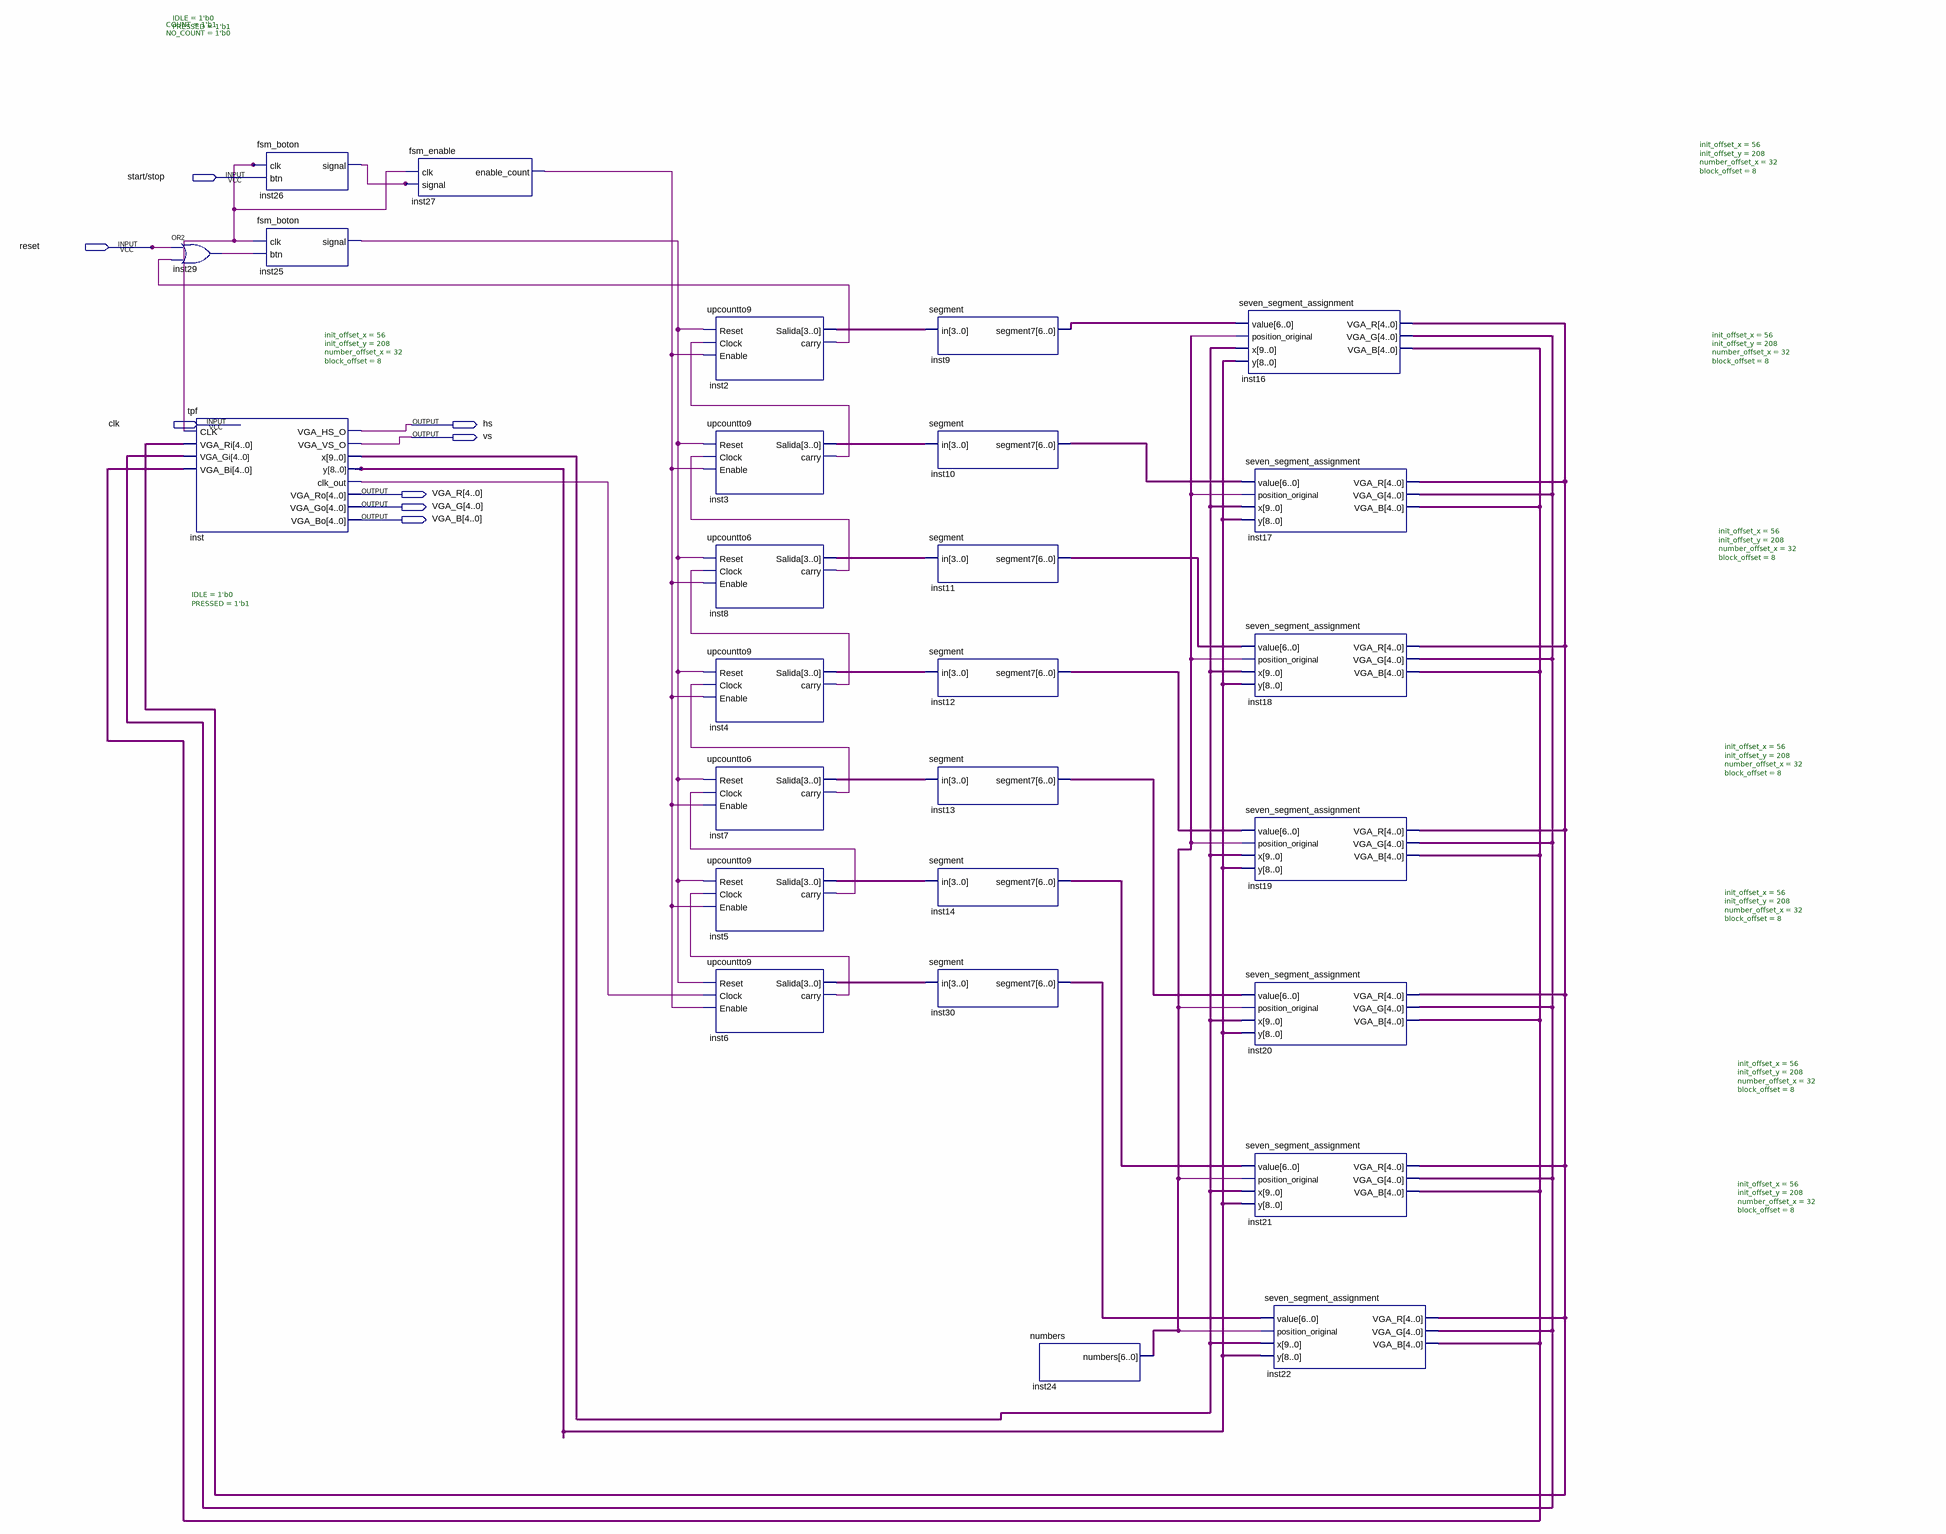
[diagram p0: schematic sheet]
// Quartus schematic TPfinalelectro3.bdf as structural Verilog: 27 symbols, 8 pins
module TPfinalelectro3 (
  input  \start/stop ,
  input  reset,
  input  clk,
  output hs,
  output vs,
  output [4:0] VGA_R,
  output [4:0] VGA_G,
  output [4:0] VGA_B
);

  wire inst2_carry, inst3_carry, inst4_carry, inst5_carry, inst6_carry, inst7_carry, inst8_carry,
       inst25_signal, inst26_signal, inst27_enable_count, inst29_out, inst_clk_out, undriven, undriven_2,
       undriven_3, undriven_4, undriven_5, undriven_6, undriven_7, undriven_8;
  wire [3:0] inst2_salida, inst3_salida, inst4_salida, inst5_salida, inst6_salida, inst7_salida, inst8_salida;
  wire [4:0] inst16_vga_b, inst16_vga_g, inst16_vga_r;
  wire [6:0] inst9_segment7, inst10_segment7, inst11_segment7, inst12_segment7, inst13_segment7,
       inst14_segment7, inst24_numbers, inst30_segment7;
  wire [8:0] inst_y;
  wire [9:0] inst_x;

  or inst29 (inst29_out, reset, inst2_carry);
  tpf #(.init_offset_x(56), .init_offset_y(208), .number_offset_x(32), .block_offset(8)) inst (
    .CLK(undriven_8), .VGA_Ri(inst16_vga_r), .VGA_Gi(inst16_vga_g), .VGA_Bi(inst16_vga_b), .VGA_HS_O(hs),
    .VGA_VS_O(vs), .x(inst_x), .y(inst_y), .clk_out(inst_clk_out), .VGA_Ro(VGA_R), .VGA_Go(VGA_G),
    .VGA_Bo(VGA_B));
  fsm_boton #(.IDLE(1'b0), .PRESSED(1'b1)) inst26 (.clk(undriven_8), .signal(inst26_signal));  // open: btn
  fsm_boton #(.IDLE(1'b0), .PRESSED(1'b1)) inst25 (.clk(undriven_8), .btn(inst29_out), .signal(inst25_signal));
  fsm_enable #(.COUNT(1'b1), .NO_COUNT(1'b0)) inst27 (
    .clk(undriven_8), .signal(inst26_signal), .enable_count(inst27_enable_count));
  upcountto9 inst2 (
    .Reset(inst25_signal), .Clock(inst3_carry), .Enable(inst27_enable_count), .Salida(inst2_salida),
    .carry(inst2_carry));
  upcountto9 inst3 (
    .Reset(inst25_signal), .Clock(inst8_carry), .Enable(inst27_enable_count), .Salida(inst3_salida),
    .carry(inst3_carry));
  upcountto6 inst8 (
    .Reset(inst25_signal), .Clock(inst4_carry), .Enable(inst27_enable_count), .Salida(inst8_salida),
    .carry(inst8_carry));
  upcountto9 inst4 (
    .Reset(inst25_signal), .Clock(inst7_carry), .Enable(inst27_enable_count), .Salida(inst4_salida),
    .carry(inst4_carry));
  upcountto6 inst7 (
    .Reset(inst25_signal), .Clock(inst5_carry), .Enable(inst27_enable_count), .Salida(inst7_salida),
    .carry(inst7_carry));
  upcountto9 inst5 (
    .Reset(inst25_signal), .Clock(inst6_carry), .Enable(inst27_enable_count), .Salida(inst5_salida),
    .carry(inst5_carry));
  upcountto9 inst6 (
    .Reset(inst25_signal), .Clock(inst_clk_out), .Enable(inst27_enable_count), .Salida(inst6_salida),
    .carry(inst6_carry));
  segment inst9 (.in(inst2_salida), .segment7(inst9_segment7));
  segment inst10 (.in(inst3_salida), .segment7(inst10_segment7));
  segment inst11 (.in(inst8_salida), .segment7(inst11_segment7));
  segment inst12 (.in(inst4_salida), .segment7(inst12_segment7));
  segment inst13 (.in(inst7_salida), .segment7(inst13_segment7));
  segment inst14 (.in(inst5_salida), .segment7(inst14_segment7));
  segment inst30 (.in(inst6_salida), .segment7(inst30_segment7));
  numbers inst24 (.numbers(inst24_numbers));
  seven_segment_assignment #(.init_offset_x(56), .init_offset_y(208), .number_offset_x(32), .block_offset(8)) inst16 (
    .value(inst9_segment7), .position_original(undriven), .x(inst_x), .y(inst_y), .VGA_R(inst16_vga_r),
    .VGA_G(inst16_vga_g), .VGA_B(inst16_vga_b));
  seven_segment_assignment #(.init_offset_x(56), .init_offset_y(208), .number_offset_x(32), .block_offset(8)) inst17 (
    .value(inst10_segment7), .position_original(undriven_2), .x(inst_x), .y(inst_y), .VGA_R(inst16_vga_r),
    .VGA_G(inst16_vga_g), .VGA_B(inst16_vga_b));
  seven_segment_assignment #(.init_offset_x(56), .init_offset_y(208), .number_offset_x(32), .block_offset(8)) inst18 (
    .value(inst11_segment7), .position_original(undriven_3), .x(inst_x), .y(inst_y), .VGA_R(inst16_vga_r),
    .VGA_G(inst16_vga_g), .VGA_B(inst16_vga_b));
  seven_segment_assignment #(.init_offset_x(56), .init_offset_y(208), .number_offset_x(32), .block_offset(8)) inst19 (
    .value(inst12_segment7), .position_original(undriven_4), .x(inst_x), .y(inst_y), .VGA_R(inst16_vga_r),
    .VGA_G(inst16_vga_g), .VGA_B(inst16_vga_b));
  seven_segment_assignment #(.init_offset_x(56), .init_offset_y(208), .number_offset_x(32), .block_offset(8)) inst20 (
    .value(inst13_segment7), .position_original(undriven_6), .x(inst_x), .y(inst_y), .VGA_R(inst16_vga_r),
    .VGA_G(inst16_vga_g), .VGA_B(inst16_vga_b));
  seven_segment_assignment #(.init_offset_x(56), .init_offset_y(208), .number_offset_x(32), .block_offset(8)) inst21 (
    .value(inst14_segment7), .position_original(undriven_5), .x(inst_x), .y(inst_y), .VGA_R(inst16_vga_r),
    .VGA_G(inst16_vga_g), .VGA_B(inst16_vga_b));
  seven_segment_assignment #(.init_offset_x(56), .init_offset_y(208), .number_offset_x(32), .block_offset(8)) inst22 (
    .value(inst30_segment7), .position_original(undriven_7), .x(inst_x), .y(inst_y), .VGA_R(inst16_vga_r),
    .VGA_G(inst16_vga_g), .VGA_B(inst16_vga_b));
endmodule
